# EAGLE design esp12Sensors (EAGLE 7.7.0)
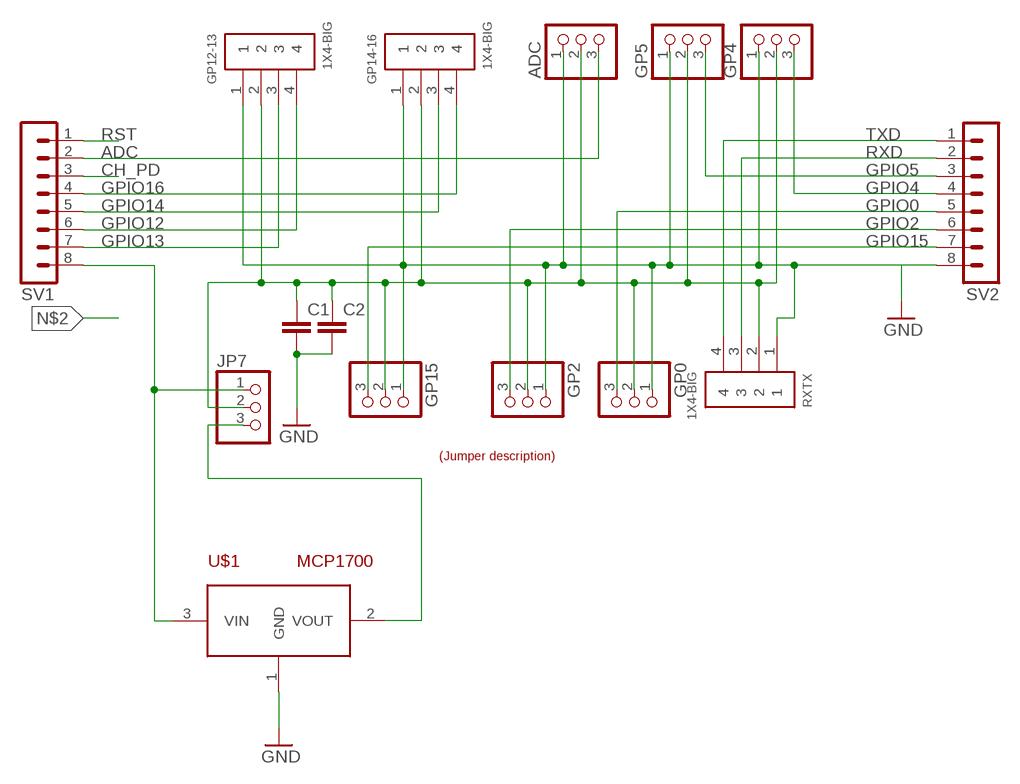
[diagram p0: schematic, sheet 1]

## Parts
ADC  PINHD-1X3  [1X03]
C1  C-EUC0805  [C0805]
C2  C-EUC0805  [C0805]
GP0  PINHD-1X3  [1X03]
GP2  PINHD-1X3  [1X03]
GP4  PINHD-1X3  [1X03]
GP5  PINHD-1X3  [1X03]
GP12-13  1X4-BIG  [1X04-BIG]
GP14-16  1X4-BIG  [1X04-BIG]
GP15  PINHD-1X3  [1X03]
JP7  PINHD-1X3  [1X03]
RXTX  1X4-BIG  [1X04-BIG]
SV1  MA08-1  [MA08-1]
SV2  MA08-1  [MA08-1]
U$1  MCP1700  [SOT-23]
U$2  LABEL_JUMPER_1X3  [JUMP3_DESC]

## Nets
3V3: JP7.3 U$1.2(VOUT)
ADC: ADC.3 SV1.2
CH_PD: SV1.3
GND: ADC.1 C1.2 C2.2 GP0.1 GP2.1 GP4.1 GP5.1 GP12-13.1 GP14-16.1 GP15.1 RXTX.1 SV2.8 U$1.1(GND)
GP12-13: JP7.1 SV1.8 U$1.3(VIN)
GPIO0: GP0.3 SV2.5
GPIO2: GP2.3 SV2.6
GPIO4: GP4.3 SV2.4
GPIO5: GP5.3 SV2.3
GPIO12: GP12-13.3 SV1.7
GPIO13: GP12-13.4 SV1.6
GPIO14: GP14-16.3 SV1.5
GPIO15: GP15.3 SV2.7
GPIO16: GP14-16.4 SV1.4
RST: SV1.1
RXD: RXTX.3 SV2.2
TXD: RXTX.4 SV2.1
VCC: ADC.2 C1.1 C2.1 GP0.2 GP2.2 GP4.2 GP5.2 GP12-13.2 GP14-16.2 GP15.2 JP7.2 RXTX.2

## Library data of the parts
ADC GP0 GP2 GP4 GP5 GP15 JP7 = adafruit:PINHD-1X3: PIN HEADER
C1 C2 = rcl:C-EU: CAPACITOR, European symbol
GP12-13 GP14-16 RXTX = adafruit:1X4: 4-pin connector
SV1 SV2 = con-lstb:MA08-1: PIN HEADER; OC_FARNELL: unknown; OC_NEWARK: unknown
U$1 = mcp1700:MCP1700
U$2 = dp_devices:LABEL_JUMPER_1X3: Nice formatted three legged jumperdescription Use attributes to change the values LEFT = With jumper to the left RIGHT = With jumper to the right; LEFT: 5V; RIGHT: 3V3

## Board
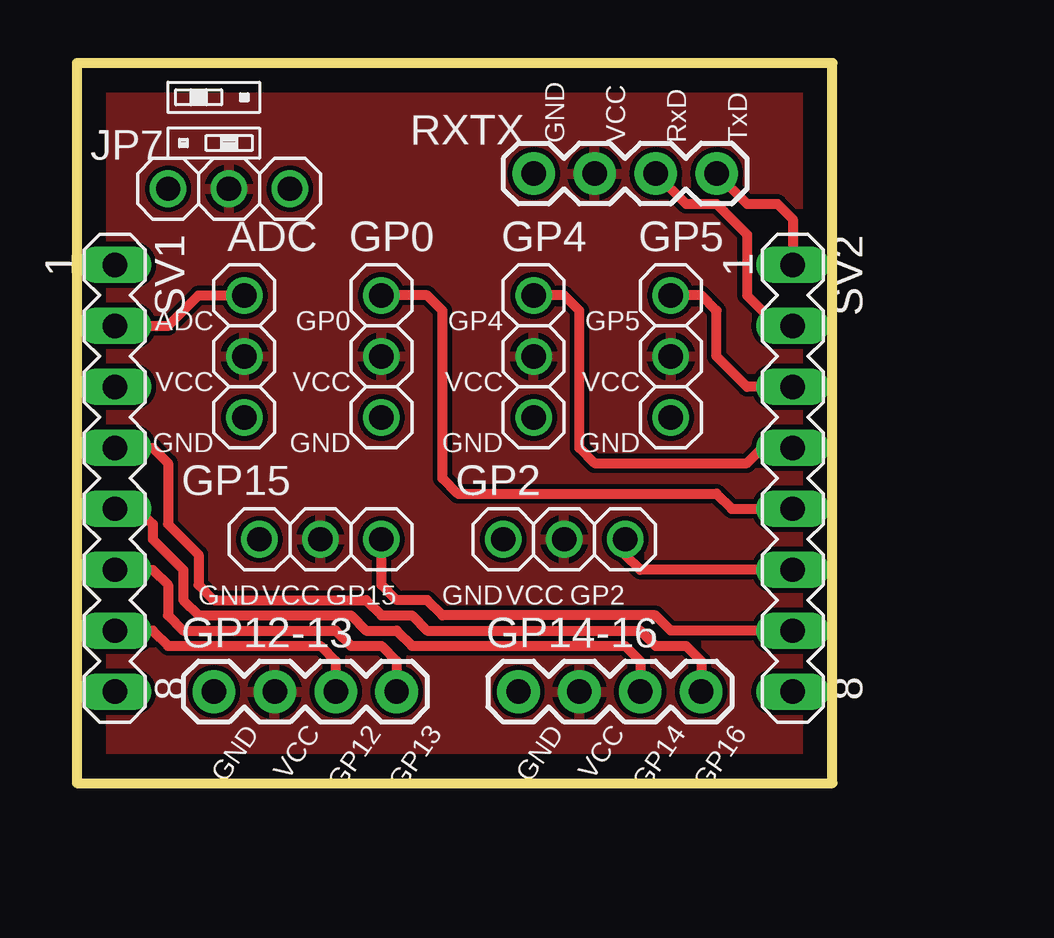
[diagram p1: board, top side]
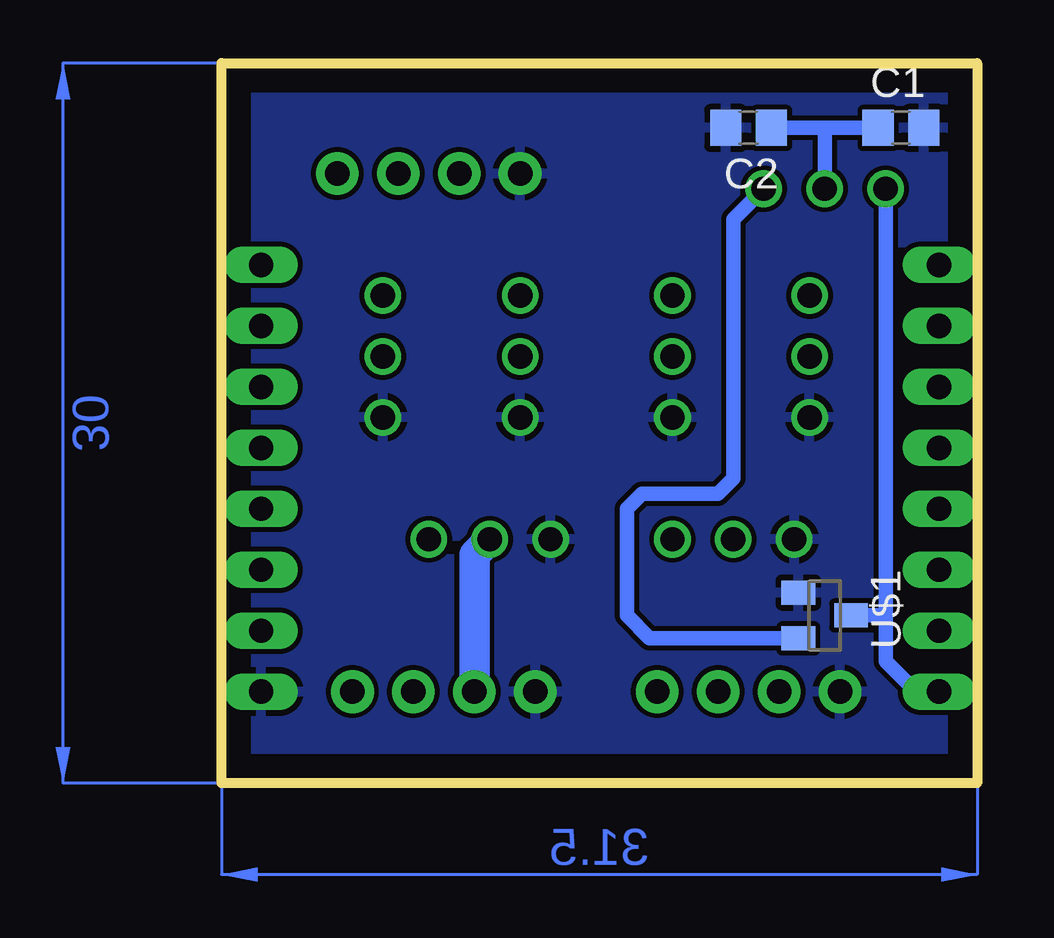
[diagram p2: board, bottom side, seen from below]

Size 31.5 x 30 mm. Coordinates in mm from the lower left corner, seen from the top.
Outline: 0,0 31.5,0 31.5,30 0,30 0,0
Copper layers (1*16): Top 0.035mm / dielectric 1.5mm / Bottom 0.035mm
Design rules "default": minimum track width 10mil, minimum drill 24mil, track to track 8mil, track to pad 8mil, pad to pad 8mil, via to via 8mil, smd to smd 8mil, copper to edge 40mil, drill to drill 8mil, minimum pad ring 10mil, minimum via ring 8mil, stop-mask expansion 4mil, vias tented up to drill 0mil, thermal gap 10mil

### Footprints (pad centres in the part's own frame; a part is rotated, then mirrored left to right if it is on the bottom)
1X03 = drill 1.016: 1 -2.54,0; 2 0,0; 3 2.54,0
C0805 = smd 1.3 x 1.5: 1 -0.95,0; 2 0.95,0
1X04-BIG = drill 1.016 pad 1.778: 1 0,0; 2 2.54,0; 3 5.08,0; 4 7.62,0
MA08-1 = drill 1.016 long: 1 -8.89,0; 2 -6.35,0; 3 -3.81,0; 4 -1.27,0; 5 1.27,0; 6 3.81,0; 7 6.35,0; 8 8.89,0
SOT-23 = smd 1 x 1.4: 1 -0.95,-1.1; 2 0.95,-1.1; 3 0,1.1

### Placement (x,y rotation side)
ADC  6.99,17.78 90 top
C1  3.17,27.3 0 bottom
C2  9.53,27.3 180 bottom
GP0  12.7,17.78 90 top
GP2  20.32,10.16 0 top
GP4  19.05,17.78 90 top
GP5  24.77,17.78 90 top
GP12-13  5.71,3.81 0 top
GP14-16  18.41,3.81 0 top
GP15  10.16,10.16 0 top
JP7  6.35,24.77 0 top
RXTX  19.05,25.4 0 top
SV1  1.59,12.7 270 top
SV2  29.84,12.7 270 top
U$1  6.35,6.99 270 bottom
U$2  8.89,27.3 0 top

### Tracks (layer width: path | path; a pad name or v marks a point on that pad's centre or on a via)
3V3
  Bottom 0.61: JP7.3 10.16,23.5 10.16,12.7 10.79,12.06 13.97,12.06 14.61,11.43 14.61,6.99 13.65,6.04 U$1.2
ADC
  Top 0.406: SV1.2 3.81,19.05 5.08,20.32 ADC.3
GND
  pour Bottom: 0,30.48 31.75,30.48 31.75,0 0,0
GP12-13
  Bottom 0.61: JP7.1 3.81,6.99 | 3.81,6.99 3.81,5.08 2.54,3.81 SV1.8 | U$1.3 3.81,6.99
GPIO0
  Top 0.406: SV2.5 27.3,11.43 26.67,12.06 15.88,12.06 15.24,12.7 15.24,19.68 14.61,20.32 GP0.3
GPIO2
  Top 0.406: SV2.6 23.5,8.89 22.86,9.53 GP2.3
GPIO4
  Top 0.406: SV2.4 28.57,13.97 27.94,13.34 21.59,13.34 20.95,13.97 20.95,19.68 20.32,20.32 GP4.3
GPIO5
  Top 0.406: SV2.3 27.94,16.51 26.67,17.78 26.67,19.68 26.04,20.32 GP5.3
GPIO12
  Top 0.406: SV1.7 3.17,6.35 3.81,5.71 10.16,5.71 10.79,5.08 GP12-13.3
GPIO13
  Top 0.406: SV1.6 3.17,8.89 3.81,8.26 3.81,6.99 4.45,6.35 10.79,6.35 11.43,5.71 12.7,5.71 13.34,5.08 GP12-13.4
GPIO14
  Top 0.406: SV1.5 2.54,11.43 3.17,10.79 3.17,10.16 4.45,8.89 4.45,7.62 5.08,6.99 11.43,6.99 12.06,6.35 13.34,6.35 13.97,5.71 22.86,5.71 23.5,5.08 GP14-16.3
GPIO15
  Top 0.406: SV2.7 24.77,6.35 24.13,6.99 15.24,6.99 14.61,7.62 13.34,7.62 12.7,8.26 GP15.3
GPIO16
  Top 0.406: SV1.4 3.17,13.97 3.81,13.34 3.81,10.79 5.08,9.53 5.08,8.26 5.71,7.62 12.06,7.62 12.7,6.99 13.97,6.99 14.61,6.35 23.5,6.35 24.13,5.71 25.4,5.71 26.04,5.08 GP14-16.4
RXD
  Top 0.406: RXTX.3 25.4,24.13 26.67,24.13 27.94,22.86 27.94,20.32 29.21,19.05 SV2.2
TXD
  Top 0.406: RXTX.4 27.94,24.13 29.21,24.13 29.84,23.5 SV2.1
VCC
  Bottom 0.61: C1.1 6.35,27.3 | 6.35,27.3 C2.1 | JP7.2 6.35,27.3
  Bottom 1.27: GP14-16.2 20.95,9.53 GP2.2
  pour Top: 0,30.48 31.75,30.48 31.75,0 0,0
(copper drawn outside any net)
  shapes: Bottom area x2

### Text on the board
tNames: GND | VCC | RxD | TxD | ADC | GP0 | GP4 | GP5 | VCC | VCC | VCC | VCC | GND | GND | GND | GND | GND | VCC | GP15 | GND | VCC | GP2 | GND | VCC | GP12 | GP13 | GND | VCC | GP14 | GP16